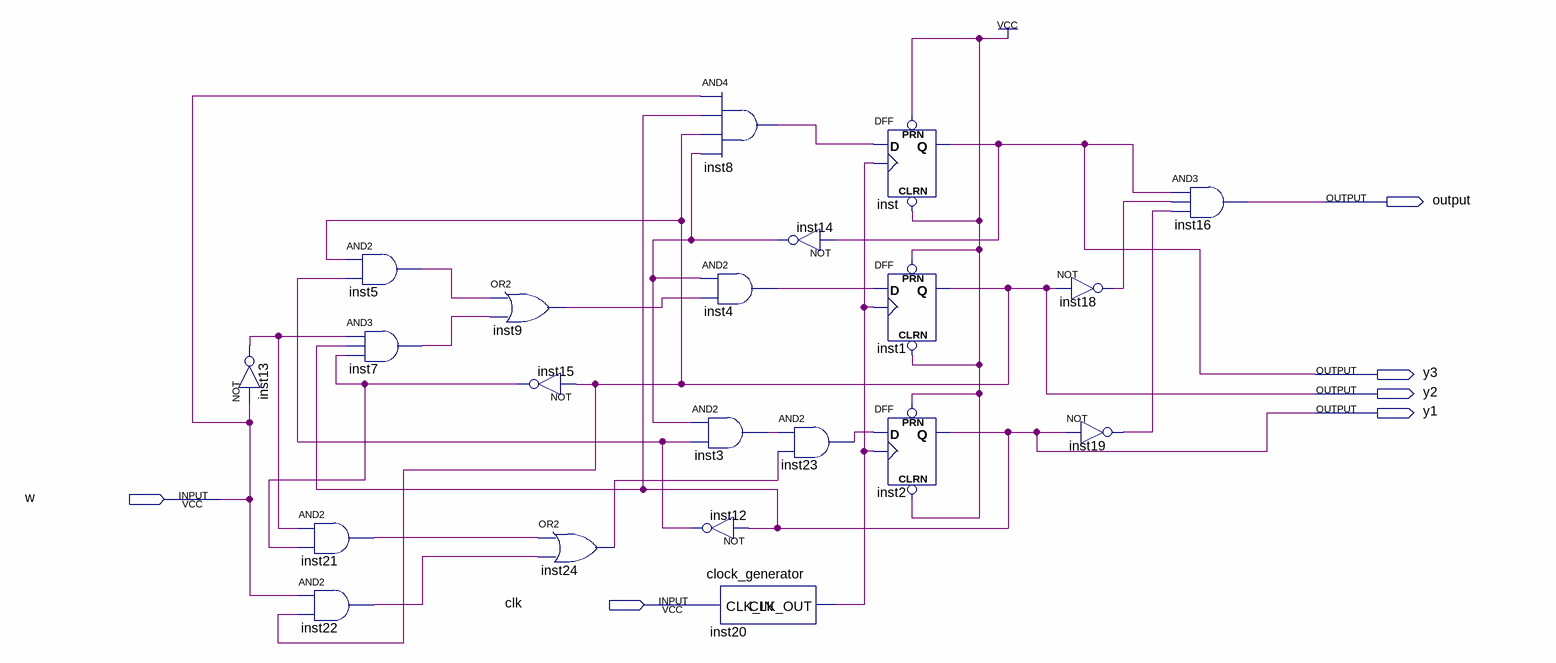
[diagram p0: schematic sheet]
// Quartus schematic labfinal.bdf as structural Verilog: 21 symbols, 6 pins
module labfinal (
  input  w,
  input  clk,
  output \output ,
  output y3,
  output y2,
  output y1
);

  wire inst3_out, inst4_out, inst5_out, inst7_out, inst8_out, inst9_out, inst12_out, inst13_out, inst14_out,
       inst15_out, inst18_out, inst19_out, inst20_clk_out, inst21_out, inst22_out, inst23_out, inst24_out;

  not inst13 (inst13_out, w);
  and inst5 (inst5_out, y2, inst12_out);
  and inst7 (inst7_out, inst13_out, y1, inst15_out);
  and inst21 (inst21_out, inst13_out, inst15_out);
  and inst22 (inst22_out, w, y2);
  or inst9 (inst9_out, inst5_out, inst7_out);
  not inst15 (inst15_out, y2);
  or inst24 (inst24_out, inst21_out, inst22_out);
  and inst8 (inst8_out, w, y1, y2, inst14_out);
  and inst4 (inst4_out, inst14_out, inst9_out);
  and inst3 (inst3_out, inst14_out, inst12_out);
  not inst12 (inst12_out, y1);
  clock_generator inst20 (.CLK_IN(clk), .CLK_OUT(inst20_clk_out));
  not inst14 (inst14_out, y3);
  and inst23 (inst23_out, inst3_out, inst24_out);
  DFF inst (.CLRN(1'b1), .CLK(inst20_clk_out), .D(inst8_out), .PRN(1'b1), .Q(y3));
  DFF inst1 (.CLRN(1'b1), .CLK(inst20_clk_out), .D(inst4_out), .PRN(1'b1), .Q(y2));
  DFF inst2 (.CLRN(1'b1), .CLK(inst20_clk_out), .D(inst23_out), .PRN(1'b1), .Q(y1));
  not inst18 (inst18_out, y2);
  not inst19 (inst19_out, y1);
  and inst16 (\output , y3, inst18_out, inst19_out);
endmodule
